# Altium project project.PrjPcb
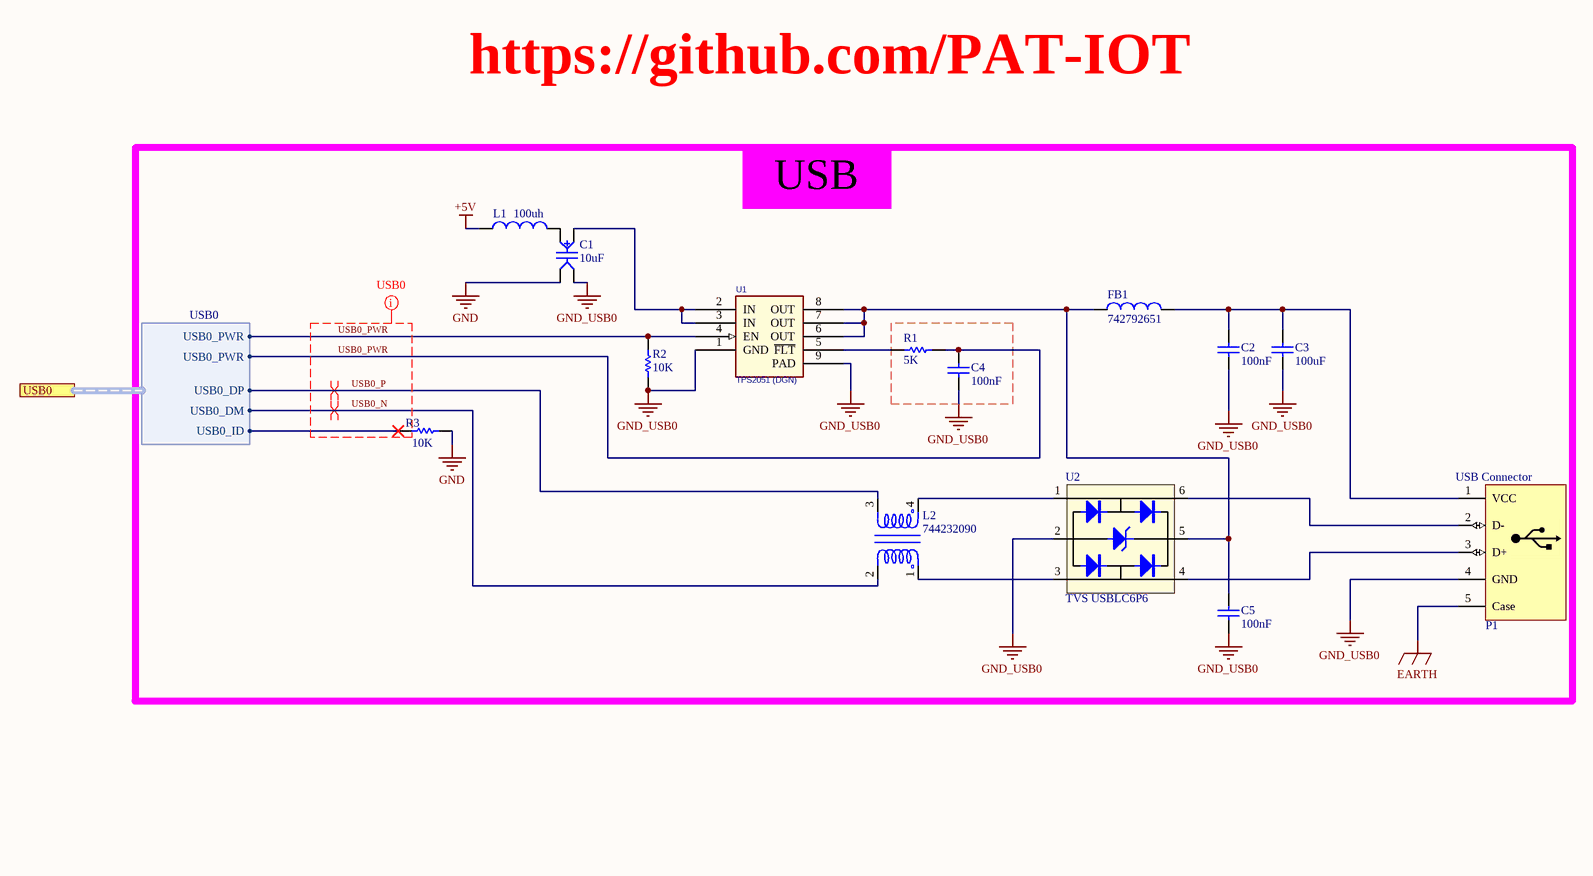
[diagram p0: USB.SchDoc]
1 sheet, 14 parts. Net scope: flat (ports and power ports of the same name join across sheets).
Board file: PCB.PcbDoc

## Sheet USB.SchDoc
size B; DocumentNumber: 11; SheetNumber: 11; SheetTotal: 16

### Parts
C1  10uF  [CAP0805 - Low Noise]
C2  100nF  [CAP0805]
C3  100uF  [CAP0805]
C4  100nF  [CAP0805]
C5  100nF  [CAP0805]
FB1  742792651  [FB0603]
L1  100uh  [IND0805]
L2  744232090  [IND_744232090]
P1  USB Connector  [USB2.5-2H4C Flash]
R1  5K  [RES0603]
R2  10K  [RES0603]
R3  10K  [RES0603_(1608X06L)]
U1  TPS2051 (DGN)  [*SOP65P490X110-9N_PMIC-TPS2051BDGN(MSOP8)(Primary)]
U2  TVS USBLC6P6  [TI SOT-23-6 DBV]

### Ports
USB0 (harness USB0)

### Harnesses
USB0: USB0_PWR, USB0_DP, USB0_DM, USB0_ID, USB0_PWR

### Nets
+5V: L1.1
EARTH: P1.5(Case)
GND: C1.4 R3.1
GND_USB0: C1.2 C2.1 C3.1 C4.1 C5.1 P1.4(GND) R2.2 U1.1(GND) U1.9(PAD) U2.2(GND)
USB0_N: L2.2 ; port USB0.USB0_DM
USB0_P: L2.3 ; port USB0.USB0_DP
USB0_PWR: C4.2 R1.2 R2.1 U1.4(EN) ; port USB0.USB0_PWR
NetC1_1: C1.1 U1.2(IN) U1.3(IN)
NetC1_3: C1.3 L1.2
NetC2_2: C2.2 C3.2 FB1.2 P1.1(VCC)
NetC5_2: C5.2 FB1.1 U1.6(OUT) U1.7(OUT) U1.8(OUT) U2.5(VCC)
NetL2_1: L2.1 U2.3(IN2)
NetL2_4: L2.4 U2.1(IN1)
NetP1_2: P1.2(D-) U2.6(OUT1)
NetP1_3: P1.3(D+) U2.4(OUT2)
NetR1_1: R1.1 U1.5(~{FLT})
NetR3_2: R3.2 ; port USB0.USB0_ID

### Layout directives
net class Undefined: USB0_N, USB0_P, USB0_PWR
differential pair: USB0_N, USB0_P

### Notes on the sheet
- https://github.com/PAT-IOT
- USB

### Library data of the parts
C1 = Capacitor Low Noise: Capacitor Ceramic; 0-Designer: Telegram: @PATARM; 1-Package: CAP0805; 0-value: 10uf
C2-C5 = Capacitor SMD: Designer: Abbas Basereh; Desc.: CAP SMD TOTAL PACKAGES; Data: 2017-3-10
  C2 C4 C5: VALUE: 100nF
  C3: VALUE: 100uF
FB1 = 742792651: 600 Ohms @ 100MHz 1 Signal Line Ferrite Bead 0603 (1608 Metric) 1A 200mOhm; MF: Wurth Electronics; Price: None; Availability: Warning; Value: *; MP: 742792651; Check_prices: https://www.snapeda.com/parts/742792651/Wurth%20Electronics%20Inc./view-part/445402/?ref=eda; Purchase-URL: https://pricing.snapeda.com/search/part/742792651/?ref=eda; SnapEDA_Link: https://www.snapeda.com/parts/742792651/Wurth%20Electronics%20Inc./view-part/445402/?ref=snap; Package: 0603 Wurth Electronics
L1 = INDUCTOR SMD PACKAGE: TOTAL INDUCTOR SMD PACK; Designer: Abbas Basereh; Desc.: INDUCTOR  SMD TOTAL PACKAGES; Data: 2017-3-10; VALUE: 100uh
L2 = 744232090: 2 Line Common Mode Choke Surface Mount 90 Ohms @ 100MHz 370mA DCR 300mOhm; MF: Wurth Electronics; MP: 744232090; Package: Horizontal-4 Wurth; Digi-Key_Part_Number: 732-1469-1-ND; Value: *; SnapEDA_Link: https://www.snapeda.com/parts/744232090/Wurth%20Electronics%20Inc./view-part/524159/?ref=snap; Digi-Key_Purchase_URL: https://www.digikey.com/product-detail/en/w-rth-elektronik/744232090/732-1469-1-ND/1639481?utm_source=snapeda&utm_medium=aggregator&utm_campaign=symbol
P1 = USB A-Type case: USB Connector-A Type
R1-R3 = Resistor
U1 = TPS2061_0: IC 1.5A PWR DIST SWITCH 8-SOIC; Manufacturer: Texas Instruments; Manufacturer Part Number: TPS2051BDGNR; Number of Outputs: 1; Rds (On): 135 mOhm; Internal Switch(s): Yes; Current Limit: 1A; Voltage - Input: 2.7 V ~ 5.5 V; Supplier 1: Digi-Key; Supplier Part Number 1: 296-17313-6-ND; RoHS: RoHS Compliant; Category: Integrated Circuits (ICs); Stock 1: 7065; Pricing 1: 1=1.82, 10=1.642, 25=1.4708, 100=1.3224, 250=1.1742, 500=1.026, 1000=0.8493 (USD); Type: High Side Switch; Operating Temperature: -40°C ~ 85°C; Mounting Type: Surface Mount; Package / Case: 8-TSSOP, 8-MSOP (0.118", 3.00mm Width) Exposed Pad; Supplier Device Package: 8-MSOP-PowerPad; Packaging: Digi-Reel®; ComponentLink1URL: http://www.ti.com/lit/ds/symlink/tps2051b.pdf; ComponentLink1Description: http://www.ti.com/lit/ds/symlink/tps2051b.pdf
U2 = TVS USBLC6P6: HIGH DENSITY MOUNTING PHOTOTRANSISTOR OPTICALLY COUPLED ISOLATORS; Company: IPA Co.; Creator: Saeid Jorablo; Creation Date: 1387-1-26